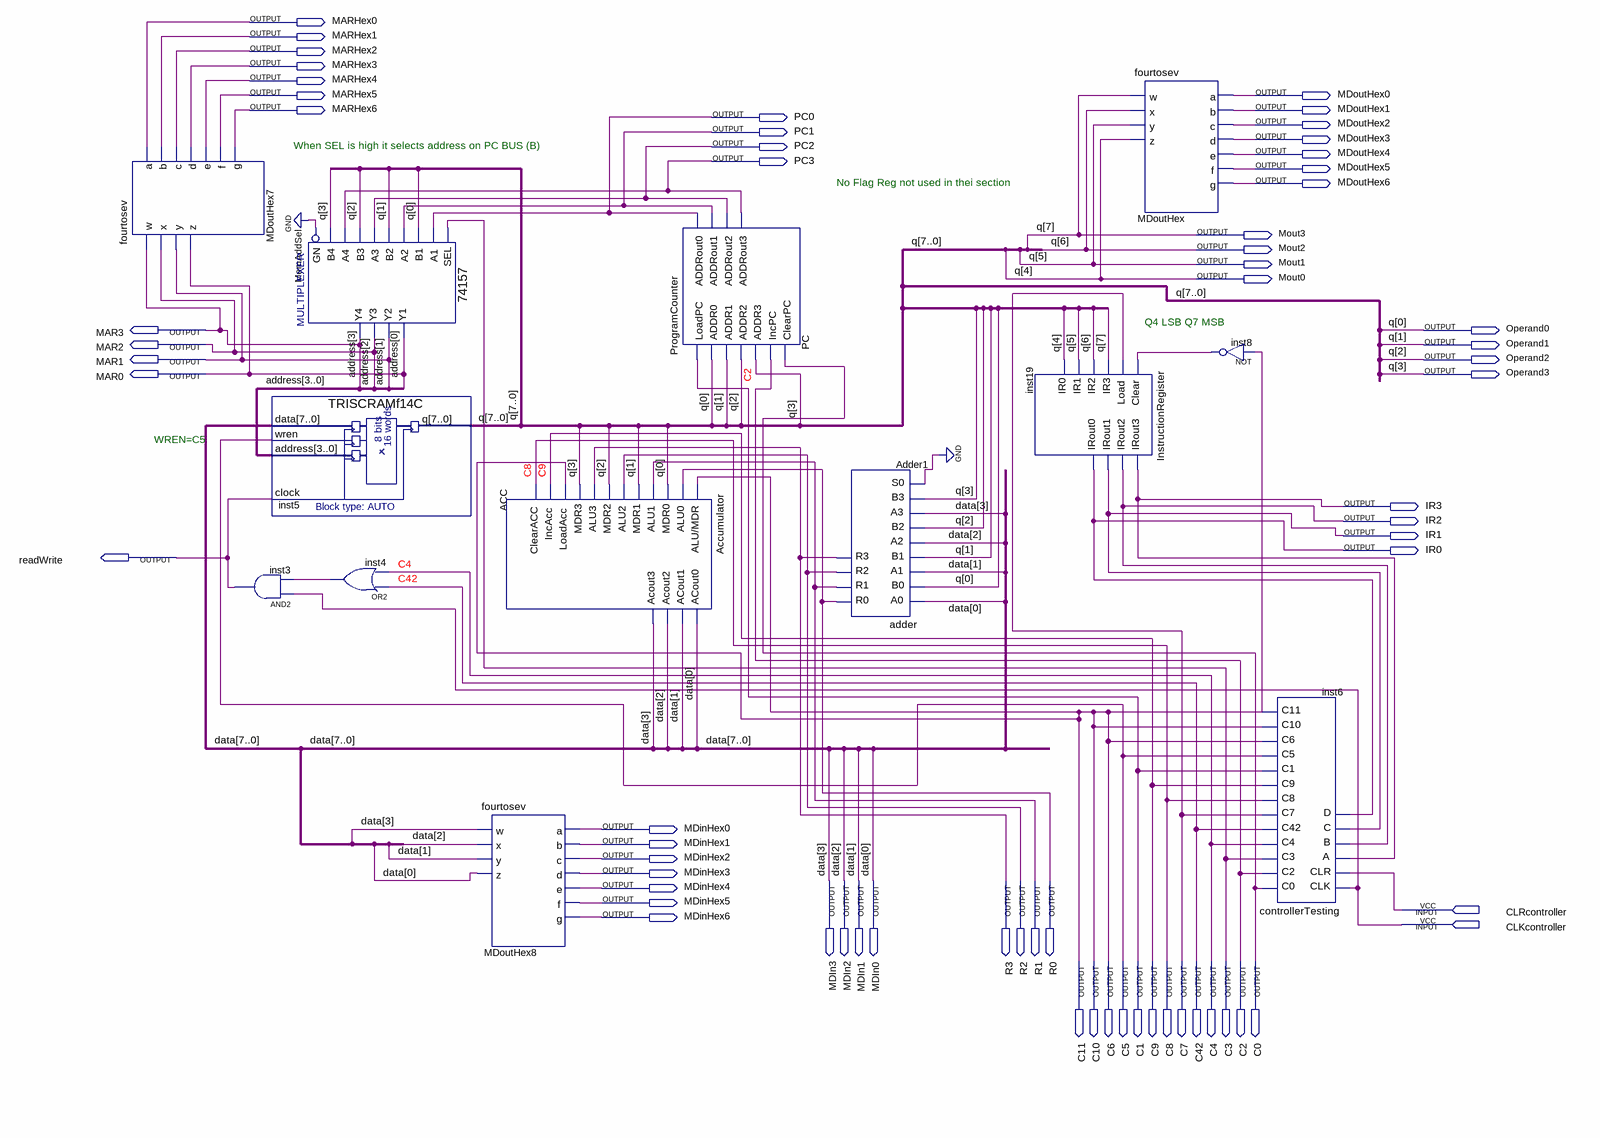
[diagram p0: schematic sheet]
// Quartus schematic partA.bdf as structural Verilog: 13 symbols, 65 pins
module partA (
  input  CLRcontroller,
  input  CLKcontroller,
  output MARHex0,
  output MARHex1,
  output MARHex2,
  output MARHex3,
  output MARHex4,
  output MARHex5,
  output MDoutHex0,
  output MARHex6,
  output MDoutHex1,
  output PC0,
  output MDoutHex2,
  output PC1,
  output MDoutHex3,
  output PC2,
  output MDoutHex4,
  output PC3,
  output MDoutHex5,
  output MDoutHex6,
  output Mout3,
  output Mout2,
  output Mout1,
  output Mout0,
  output MAR3,
  output Operand0,
  output MAR2,
  output Operand1,
  output MAR1,
  output Operand2,
  output MAR0,
  output Operand3,
  output IR3,
  output IR2,
  output IR1,
  output IR0,
  output readWrite,
  output MDinHex0,
  output MDinHex1,
  output MDinHex2,
  output MDinHex3,
  output MDIn3,
  output MDIn2,
  output MDIn1,
  output MDIn0,
  output R3,
  output R2,
  output R1,
  output R0,
  output MDinHex4,
  output MDinHex5,
  output MDinHex6,
  output C11,
  output C10,
  output C6,
  output C5,
  output C1,
  output C9,
  output C8,
  output C7,
  output C42,
  output C4,
  output C3,
  output C2,
  output C0
);

  wire inst4_out, inst8_out;
  wire [7:4] data;

  fourtosev MDoutHex7 (
    .w(MAR3), .x(MAR2), .y(MAR1), .z(MAR0), .a(MARHex0), .b(MARHex1), .c(MARHex2), .d(MARHex3), .e(MARHex4),
    .f(MARHex5), .g(MARHex6));
  TRISCRAMf14C inst5 (
    .data({data, MDIn3, MDIn2, MDIn1, MDIn0}), .wren(C5), .address({MAR3, MAR2, MAR1, MAR0}),
    .clock(readWrite), .q({Mout3, Mout2, Mout1, Mout0, Operand3, Operand2, Operand1, Operand0}));
  and inst3 (readWrite, CLKcontroller, inst4_out);
  \74157  MemAddSel (
    .A1(PC0), .B1(Operand0), .SEL(C3), .B2(Operand1), .A3(PC2), .B3(Operand2), .A2(PC1), .B4(Operand3),
    .GN(1'b0), .A4(PC3), .Y2(MAR1), .Y1(MAR0), .Y4(MAR3), .Y3(MAR2));
  or inst4 (inst4_out, C42, C4);
  Accumulator ACC (
    .\ALU/MDR (C6), .ALU0(R0), .MDR0(Operand0), .ALU1(R1), .MDR1(Operand1), .ALU2(R2), .MDR2(Operand2),
    .ALU3(R3), .MDR3(Operand3), .LoadAcc(C6), .IncAcc(C9), .ClearACC(C8), .ACout0(MDIn0), .ACout1(MDIn1),
    .Acout2(MDIn2), .Acout3(MDIn3));
  fourtosev MDoutHex8 (
    .w(MDIn3), .x(MDIn2), .y(MDIn1), .z(MDIn0), .a(MDinHex0), .b(MDinHex1), .c(MDinHex2), .d(MDinHex3),
    .e(MDinHex4), .f(MDinHex5), .g(MDinHex6));
  ProgramCounter PC (
    .LoadPC(C1), .ADDR0(Operand0), .ADDR1(Operand1), .ADDR2(Operand2), .ADDR3(Operand3), .IncPC(C2),
    .ClearPC(C0), .ADDRout0(PC0), .ADDRout1(PC1), .ADDRout2(PC2), .ADDRout3(PC3));
  adder Adder1 (
    .A0(MDIn0), .B0(Operand0), .A1(MDIn1), .B1(Operand1), .A2(MDIn2), .B2(Operand2), .A3(MDIn3),
    .B3(Operand3), .S0(1'b0), .R0(R0), .R1(R1), .R2(R2), .R3(R3));
  InstructionRegister inst19 (
    .Clear(inst8_out), .Load(C7), .IR3(Mout3), .IR2(Mout2), .IR1(Mout1), .IR0(Mout0), .IRout3(IR3),
    .IRout2(IR2), .IRout1(IR1), .IRout0(IR0));
  fourtosev MDoutHex (
    .w(Mout3), .x(Mout2), .y(Mout1), .z(Mout0), .a(MDoutHex0), .b(MDoutHex1), .c(MDoutHex2), .d(MDoutHex3),
    .e(MDoutHex4), .f(MDoutHex5), .g(MDoutHex6));
  not inst8 (inst8_out, C6);
  controllerTesting inst6 (
    .CLK(CLKcontroller), .CLR(CLRcontroller), .A(IR3), .B(IR2), .C(IR1), .D(IR0), .C0(C0), .C2(C2), .C3(C3),
    .C4(C4), .C42(C42), .C7(C7), .C8(C8), .C9(C9), .C1(C1), .C5(C5), .C6(C6), .C10(C6), .C11(C6));

  assign C10 = C6;
  assign C11 = C6;

  // Other names for the same wires on the sheet: address[3:0] = {MAR3, MAR2, MAR1, MAR0};
  //   data[3:0] = {MDIn3, MDIn2, MDIn1, MDIn0};
  //   q[7:0] = {Mout3, Mout2, Mout1, Mout0, Operand3, Operand2, Operand1, Operand0}

  // Notes on the sheet:
  //   When SEL is high it selects address on PC BUS (B)
  //   No Flag Reg not used in thei section
  //   Q4 LSB Q7 MSB
  //   WREN=C5
endmodule
